# EAGLE design H3_MIDIController_Rev_2_MainBoard (EAGLE 7.6.0)
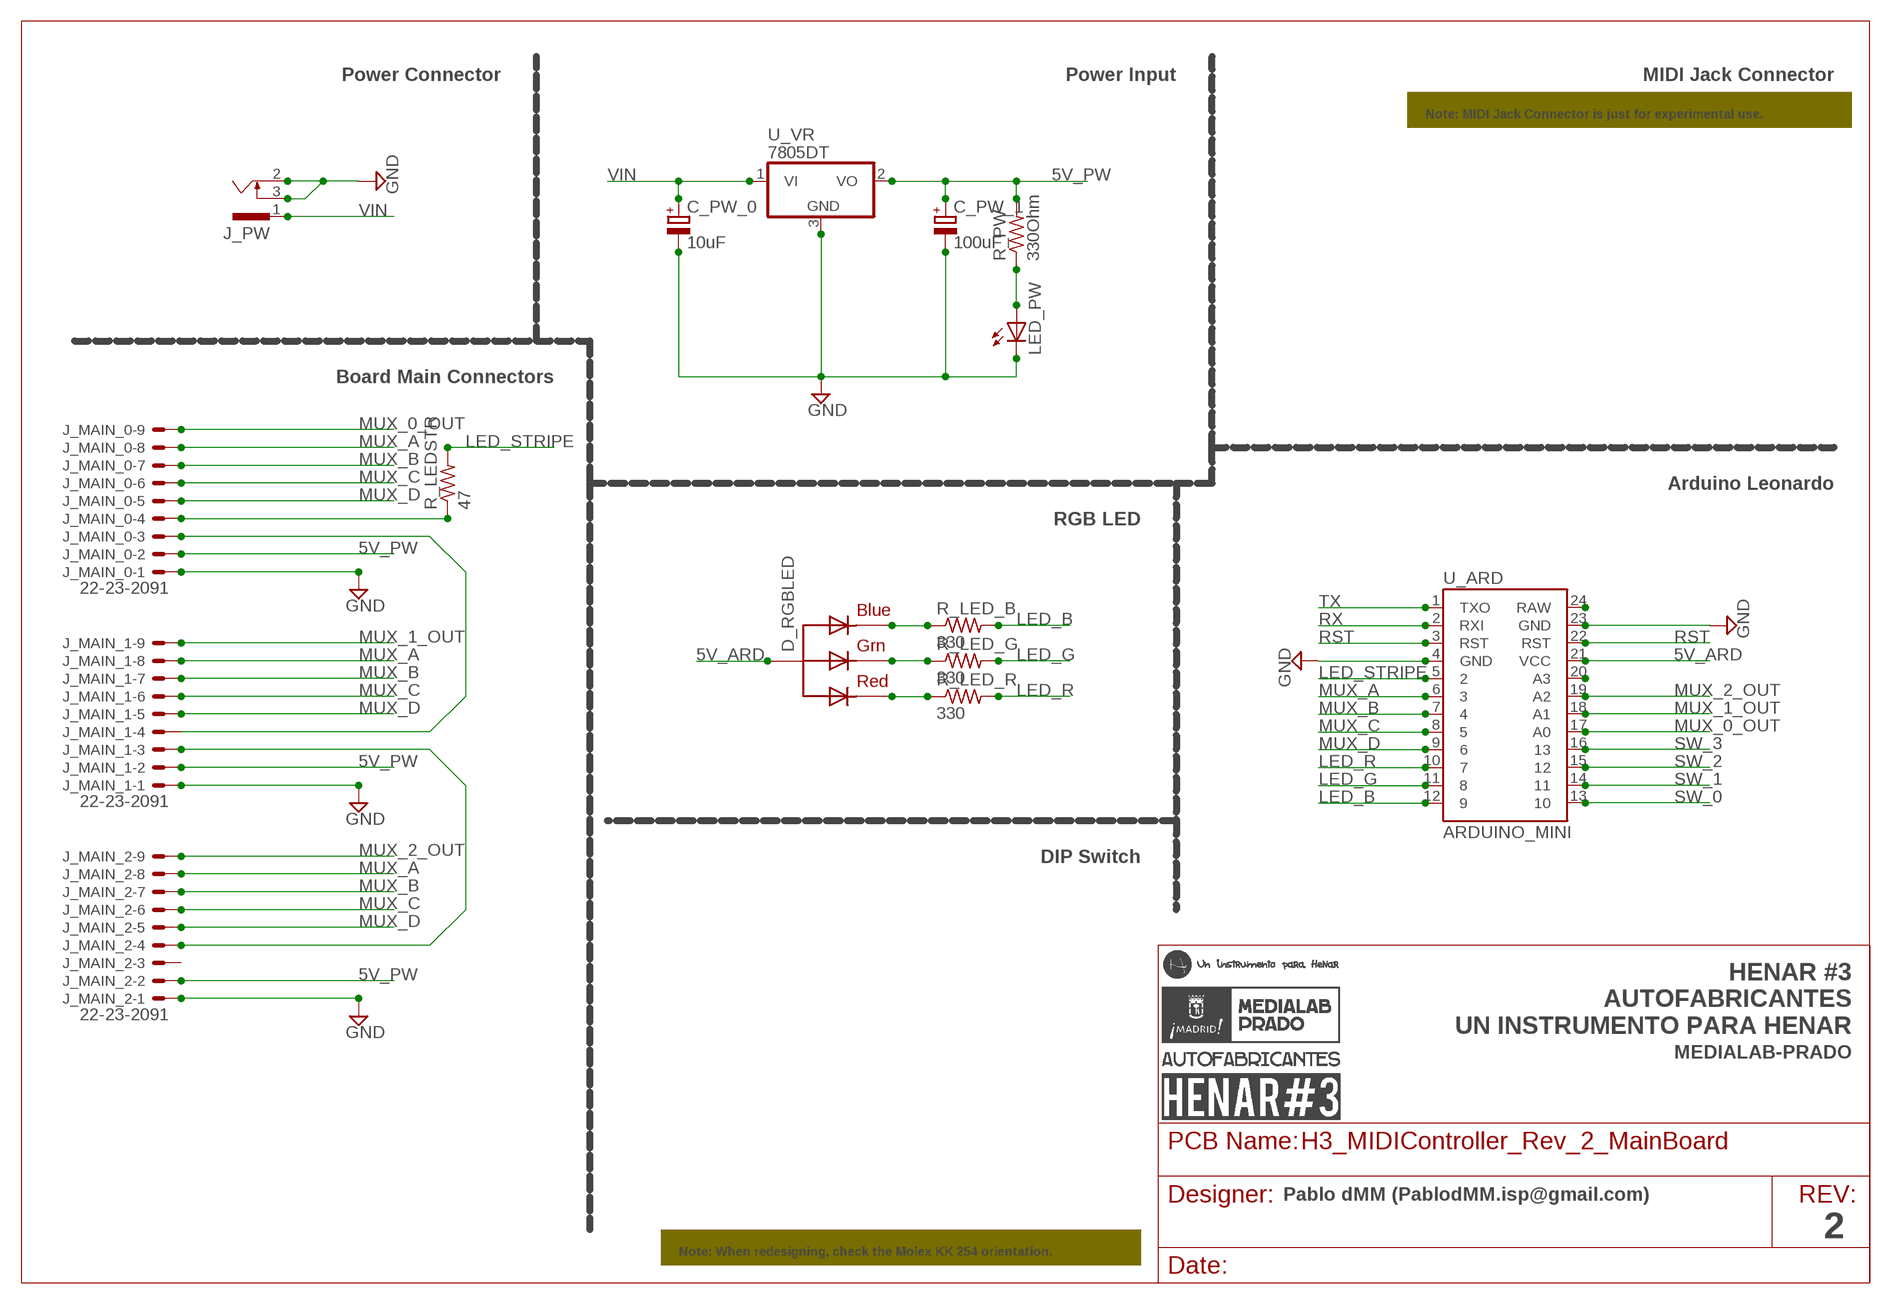
[diagram p0: schematic, sheet 1]

## Parts
C_PW_0  10uF  CPOL-EUTT2D6L  [TT2D6L]
C_PW_1  100uF  CPOL-EUTT2D6L  [TT2D6L]
D_RGBLED  RGBLED_CA-5MM  [LED5MMRGB]
J_MAIN_0  22-23-2091  [22-23-2091]
J_MAIN_1  22-23-2091  [22-23-2091]
J_MAIN_2  22-23-2091  [22-23-2091]
J_PW  SCD-014A  [SCD-014-A]
LED_PW  LEDSMT1206  [1206]
R_LED_B  330  R-US_M1206  [M1206]
R_LED_G  330  R-US_M1206  [M1206]
R_LED_R  330  R-US_M1206  [M1206]
R_LEDSTR  47  R-US_M1206  [M1206]
R_PW  330Ohm  R-US_M1206  [M1206]
U_ARD  ARDUINO_MINI  [ARDUINO_MINI]
U_VR  7805DT  [TO252]

## Nets
5V_ARD: D_RGBLED.2(VCC) U_ARD.21(VCC)
5V_PW [GND]: C_PW_1.+ J_MAIN_0.2 J_MAIN_1.2 J_MAIN_2.2 R_PW.2 U_VR.2(VO)
GND [GND]: C_PW_0.- C_PW_1.- J_MAIN_0.1 J_MAIN_1.1 J_MAIN_2.1 J_PW.2 J_PW.3 LED_PW.C U_ARD.4(GND) U_ARD.23(GND) U_VR.3(GND)
LED_B: R_LED_B.2 U_ARD.12
LED_G: R_LED_G.2 U_ARD.11
LED_OUT: J_MAIN_0.3 J_MAIN_1.4
LED_OUT1: J_MAIN_1.3 J_MAIN_2.4
LED_R: R_LED_R.2 U_ARD.10
LED_STRIPE: R_LEDSTR.2 U_ARD.5
MUX_0_OUT: J_MAIN_0.9 U_ARD.17(A0)
MUX_1_OUT: J_MAIN_1.9 U_ARD.18(A1)
MUX_2_OUT: J_MAIN_2.9 U_ARD.19(A2)
MUX_A: J_MAIN_0.8 J_MAIN_1.8 J_MAIN_2.8 U_ARD.6
MUX_B: J_MAIN_0.7 J_MAIN_1.7 J_MAIN_2.7 U_ARD.7
MUX_C: J_MAIN_0.6 J_MAIN_1.6 J_MAIN_2.6 U_ARD.8
MUX_D: J_MAIN_0.5 J_MAIN_1.5 J_MAIN_2.5 U_ARD.9
N$1: J_MAIN_0.4 R_LEDSTR.1
N$2: U_ARD.20(A3)
N$3: U_ARD.24(RAW)
N$5: LED_PW.A R_PW.1
N$8: D_RGBLED.4(BLUE) R_LED_B.1
N$9: D_RGBLED.3(GREEN) R_LED_G.1
N$10: D_RGBLED.1(RED) R_LED_R.1
RST: U_ARD.3(RST) U_ARD.22(RST)
RX: U_ARD.2(RXI)
SW_0: U_ARD.13
SW_1: U_ARD.14
SW_2: U_ARD.15
SW_3: U_ARD.16
TX: U_ARD.1(TXO)
VIN: C_PW_0.+ J_PW.1 U_VR.1(VI)
Unconnected: J_MAIN_2.3

## Notes on the sheet
- Power Connector | Power Input | MIDI Jack Connector
- Note: MIDI Jack Connector is just for experimental use.
- Board Main Connectors
- Arduino Leonardo
- RGB LED
- DIP Switch
- HENAR #3
  AUTOFABRICANTES
  UN INSTRUMENTO PARA HENAR
- MEDIALAB-PRADO
- Pablo dMM (PablodMM.isp@gmail.com)
- 2
- Note: When redesigning, check the Molex KK 254 orientation.

## Library data of the parts
C_PW_0 C_PW_1 = rcl:CPOL-EU: POLARIZED CAPACITOR, European symbol
D_RGBLED = adafruit:RGBLED_CA: RGB LED, common-anode 5MM Staggered pins 5mm Piranha package http://www.ladyada.net/library/pcb/eaglelibrary.html
J_MAIN_0 J_MAIN_1 J_MAIN_2 = con-molex:22-23-2091: .100" (2.54mm) Center Header - 9 Pin; MF: MOLEX; MPN: 22-23-2091; OC_FARNELL: 1756827; OC_NEWARK: 56H0450
J_PW = con-shiua-chyuan:SCD-014A: Power Jack 2.5mm; OC_FARNELL: unknown; OC_NEWARK: unknown
LED_PW = adafruit:LED: LED OSRAM: - CHIPLED LG R971, LG N971, LY N971, LG Q971, LY Q971, LO R971, LY R971 LH N974, LH R974 LS Q976, LO Q976, LY Q976 LO Q996 - Hyper CHIPLED LW Q18S LB Q993, LB Q99A, LB R99A - SideLED LS A670, LO A670, LY A670, LG A670, LP A670 LB A673, LV A673, LT A673, LW A673 LH A674 LY A675 LS A676, LA A676, LO A676, LY A676, LW A676 LS A679, LY A679, LG A679 - Hyper Micro SIDELED® LS Y876, LA Y876, LO Y876, LY Y876 LT Y87S - SmartLED LW L88C, LW L88S LB L89C, LB L89S, LG L890 LS L89K, LO L89K, LY L89K LS L896, LA L896, LO L896, LY L896 - TOPLED LS T670, LO T670, LY T670, LG T670, LP T670 LSG T670, LSP T670, LSY T670, LOP T670, LYG T670 LG T671, LOG T671, LSG T671 LB T673, LV T673, LT T673, LW T673 LH T674 LS T676, LA T676, LO T676, LY T676, LB T676, LH T676, LSB T676, LW T676 LB T67C, LV T67C, LT T67C, LS T67K, LO T67K, LY T67K, LW E67C LS E67B, LA E67B, LO E67B, LY E67B, LB E67C, LV E67C, LT E67C LW T67C LS T679, LY T679, LG T679 LS T770, LO T770, LY T770, LG T770, LP T770 LB T773, LV T773, LT T773, LW T773 LH T774 LS E675, LA E675, LY E675, LS T675 LS T776, LA T776, LO T776, LY T776, LB T776 LHGB T686 LT T68C, LB T68C - Hyper Mini TOPLED® LB M676 - Mini TOPLED Santana® LG M470 LS M47K, LO M47K, LY M47K Source: http://www.osram.convergy.de/
R_LED_B R_LED_G R_LED_R R_LEDSTR R_PW = adafruit:R-US_: RESISTOR, American symbol
U_ARD = SparkFun-Boards:ARDUINO_MINI: Arduino Pro Mini footprint
U_VR = adafruit:78*: Positive VOLTAGE REGULATOR Added bigger pads to the TO-92 package

## Net classes
1 GND: width 0.635 mm

## Board
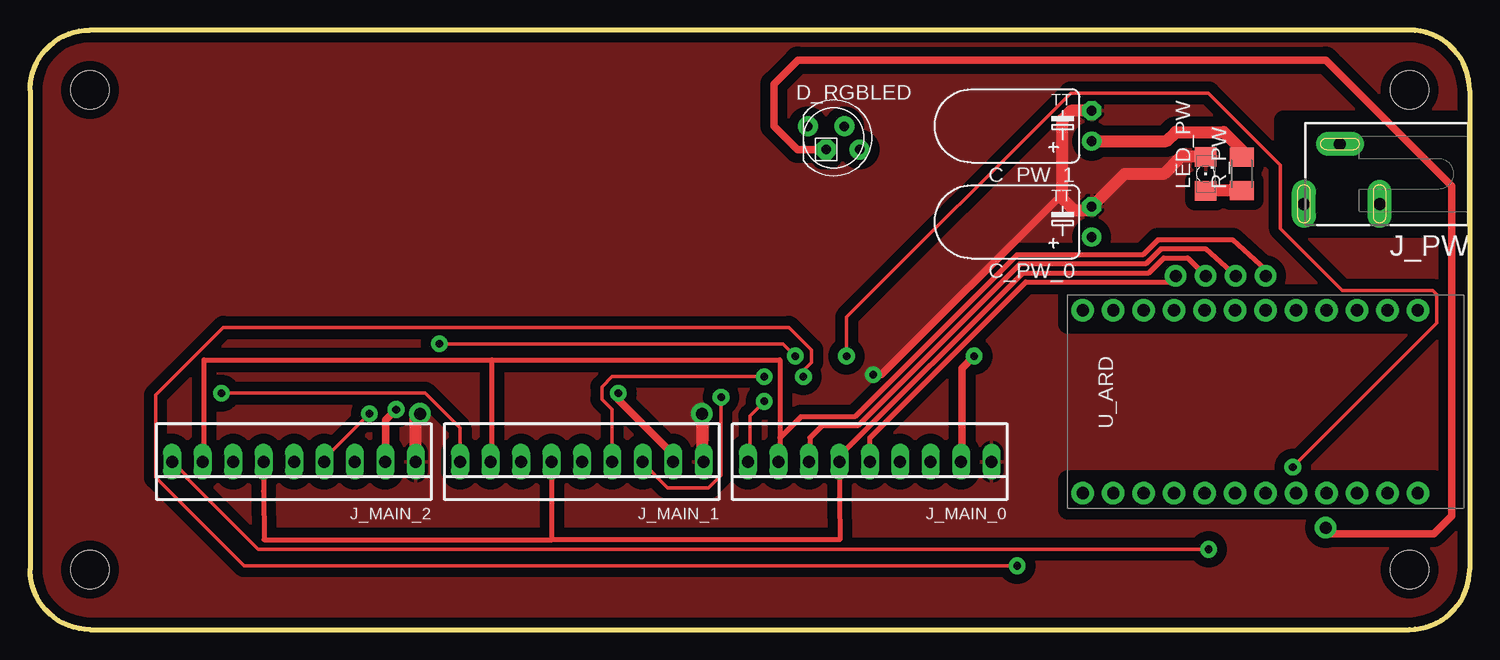
[diagram p1: board, top side]
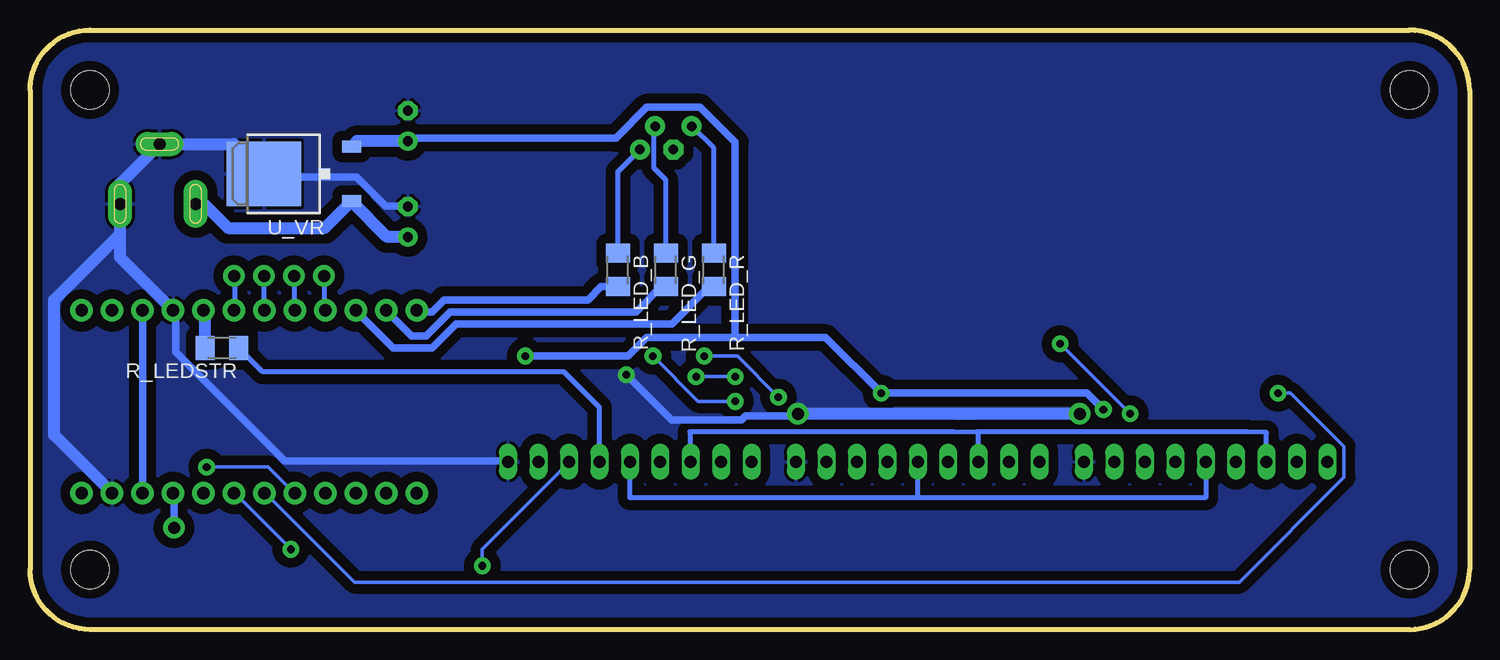
[diagram p2: board, bottom side, seen from below]

Size 120 x 50 mm. Coordinates in mm from the lower left corner, seen from the top.
Outline: 5,0 115,0 arc90 120,5 120,45 arc90 115,50 5,50 arc90 0,45 0,5 arc90 5,0
Copper layers (1*16): Top 0.035mm / dielectric 1.5mm / Bottom 0.035mm
Design rules "default *": minimum track width 12mil, minimum drill 25mil, track to track 15mil, track to pad 15mil, pad to pad 15mil, via to via 15mil, smd to smd 8mil, copper to edge 20mil, drill to drill 8mil, minimum pad ring 10mil, minimum via ring 15mil, stop-mask expansion 4mil, vias tented up to drill 0mil, thermal gap 10mil
Holes 3.2 mm at 115,45 115,5 5,5 5,45
tRestrict: area 86.5,25.5 to 117,28; area 86.5,10 to 117,12.5; area 104.5,33.5 to 120.5,42.5
vRestrict: area 106,34 to 120,42; area 11,0 to 81.5,16

### Footprints (pad centres in the part's own frame; a part is rotated, then mirrored left to right if it is on the bottom)
TT2D6L = drill 0.813 pad 1.6: + -1.27,0 | drill 0.813 pad 1.6 octagon: - 1.27,0
LED5MMRGB = drill 0.8 pad 1.676: 1 -2.159,0.968; 3 0.889,0.968; 4 2.159,-0.968 | drill 0.8 pad 1.676 octagon: 2 -0.635,-0.968
22-23-2091 = drill 1 long: 1 -10.16,0; 2 -7.62,0; 3 -5.08,0; 4 -2.54,0; 5 0,0; 6 2.54,0; 7 5.08,0; 8 7.62,0; 9 10.16,0
SCD-014-A = drill 1 pad 2 long: 1 -2.5,13.8; 2 -2.5,7.5; 3 2.5,10.8
1206 = smd 1.6 x 1.803: A -1.422,0; C 1.422,0
M1206 = smd 1.6 x 2: 1 -1.4,0; 2 1.4,0
ARDUINO_MINI = drill 1.016 pad 1.88: 1 -7.62,12.7; 2 -7.62,10.16; 3 -7.62,7.62; 4 -7.62,5.08; 5 -7.62,2.54; 6 -7.62,0; 7 -7.62,-2.54; 8 -7.62,-5.08; 9 -7.62,-7.62; 10 -7.62,-10.16; 11 -7.62,-12.7; 12 -7.62,-15.24; 13 7.62,-15.24; 14 7.62,-12.7; 15 7.62,-10.16; 16 7.62,-7.62; 17 7.62,-5.08; 18 7.62,-2.54; 19 7.62,0; 20 7.62,2.54; 21 7.62,5.08; 22 7.62,7.62; 23 7.62,10.16; 24 7.62,12.7
TO252 = smd 1 x 1.6: 1 -2.28,-4.8; 2 2.28,-4.8 | smd 5.4 x 6.2: 3 0,2.5

### Placement (x,y rotation side)
C_PW_0  88.5,34 90 top
C_PW_1  88.5,42 90 top
D_RGBLED  67,41 0 top
J_MAIN_0  70,14 180 top
J_MAIN_1  46,14 180 top
J_MAIN_2  22,14 180 top
J_PW  120,38 90 top
LED_PW  98,38 90 top
R_LED_B  71,30 270 bottom
R_LED_G  67,30 270 bottom
R_LED_R  63,30 270 bottom
R_LEDSTR  104,23.5 180 bottom
R_PW  101,38 90 top
U_ARD  103,19 270 top
U_VR  98,38 90 bottom

### Tracks (layer width: path | path; a pad name or v marks a point on that pad's centre or on a via)
5V_ARD  (via drill 1)
  Top 0.61: D_RGBLED.2 63.97,40.03 62,42 62,45.5 64,47.5 108,47.5 118.5,37 118.5,9.5 117,8 108.5,8 v108,8.5
  Bottom 0.61: v108,8.5 108,11.3 U_ARD.21
5V_PW  (via drill 0.64)
  Top 0.635: v30.52,18.34 29.66,17.49 29.66,14.06 J_MAIN_2.2 | v49.04,19.72 49.04,19.2 53.5,14.74 53.5,14.06 J_MAIN_1.2 | v78.7,22.8 77.67,21.77 77.67,14.06 J_MAIN_0.2
  Top 1.016: C_PW_1.+ 94.73,40.73 95.5,41.5 99.5,41.5 101,40 R_PW.2
  Bottom 0.635: v30.52,18.34 31.89,19.72 v49.04,19.72 53.67,24.35 61.21,24.35 | v78.7,22.8 70.13,22.8 68.58,24.35 61.21,24.35 | 61.21,24.35 61.21,40.63 64.13,43.55 68.58,43.55 71.16,40.98 88.13,40.98 C_PW_1.+
  Bottom 1.016: C_PW_1.+ 92.75,40.73 U_VR.2
GND  (via drill 0.64, 1)
  Top 0.635: v70.3,21.26 70.98,21.26 85.56,35.83 86,36
  Top 1.016: LED_PW.C 95.92,39.42 94.5,38 91.23,38 C_PW_0.- 88.23,35 87,35 86,36 86,42.5 86.77,43.27 C_PW_1.- | J_MAIN_2.1 32.16,17.66 v32.5,18 | v56,18 56,14.16 J_MAIN_1.1
  Bottom 0.635: J_MAIN_0.1 80.24,14.06 98.76,14.06 107.85,23.15 107.85,26.23 U_ARD.4 | C_PW_0.- 88.64,35.32 90.36,35.32 92.76,37.72 100.13,37.72 U_VR.3 | v70.3,21.26 66.53,17.49 60.7,17.49 60.35,17.83 56.41,17.83 v56,18
  Bottom 1.016: U_VR.3 103,40.5 J_PW.3 112.5,37.2 J_PW.2 112.5,33 | U_ARD.23 118,16.22 118,27.5 112.5,33 | U_ARD.4 112.5,31.04 112.5,33 | v32.5,18 v56,18
  pour Top (isolate 0.813): 0,5 0,45 arc-90 5,50 115,50 arc-90 120,45 120,5 arc-90 115,0 5,0 arc-90
  pour Bottom (isolate 0.813): 0,5 0,45 arc-90 5,50 115,50 arc-90 120,45 120,5 arc-90 115,0 5,0 arc-90
LED_B
  Bottom 0.61: R_LED_B.2 72.4,28.6 73.5,27.5 85.5,27.5 86.5,26.5 87.64,26.5 U_ARD.12
LED_G
  Bottom 0.61: R_LED_G.2 67.4,28.6 69.5,26.5 85,26.5 87,24.5 88.18,24.5 U_ARD.11
LED_OUT  (via drill 0.64)
  Top 0.305: v61.21,21.09 48.52,21.09 47.67,20.23 47.67,19.2 48.52,18.34 48.52,14.06 J_MAIN_1.4 | v64.47,21.09 64.47,21.6 65.16,22.29 65.16,23.32 63.27,25.2 16.12,25.2 10.46,19.55 10.46,12.69 17.84,5.32 v82.3,5.32
  Bottom 0.305: v64.47,21.09 v61.21,21.09 | v82.3,5.32 82.3,6.69 75.1,13.89 J_MAIN_0.3
LED_OUT1  (via drill 0.64)
  Top 0.305: v28.29,18 24.69,14.4 24.69,14.06 J_MAIN_2.4 | v34.12,23.83 62.75,23.83 v63.78,22.8 | v57.61,19.37 57.61,12.86 56.58,11.83 53.15,11.83 51.1,13.89 J_MAIN_1.3
  Bottom 0.305: v34.12,23.83 v28.29,18 | v63.78,22.8 61.04,22.8 v57.61,19.37
LED_R
  Bottom 0.61: R_LED_R.2 63.4,28.6 66.5,25.5 84.5,25.5 86.5,23.5 89.72,23.5 U_ARD.10
LED_STRIPE
  Bottom 1.016: R_LEDSTR.2 105.4,26.48 U_ARD.5
MUX_0_OUT  (via drill 0.64)
  Top 0.305: v61.21,19.03 60.01,17.83 60.01,14.06 J_MAIN_0.9 | v68.07,22.8 68.07,26.06 86.76,44.75 98.25,44.75 104.25,38.75 104.25,33.43 109.39,28.29 116.93,28.29 117.28,27.95 117.28,25.55 v105.27,13.54
  Bottom 0.305: v61.21,19.03 64.3,19.03 v68.07,22.8 | v105.27,13.54 100.13,13.54 98.07,11.49 U_ARD.17
MUX_1_OUT  (via drill 0.64)
  Top 0.305: v15.95,19.72 32.92,19.72 35.84,16.8 35.84,14.06 J_MAIN_1.9
  Bottom 0.305: v15.95,19.72 14.92,19.72 10.46,15.26 10.46,12.69 19.21,3.94 92.93,3.94 100.3,11.32 U_ARD.18
MUX_2_OUT  (via drill 0.64)
  Top 0.305: v98.25,6.69 19.03,6.69 13.03,12.69 13.03,12.86 12.01,13.89 J_MAIN_2.9
  Bottom 0.305: v98.25,6.69 102.87,11.32 U_ARD.19
MUX_A  (via drill 1)
  Top 0.305: J_MAIN_2.8 14.41,14.06 14.5,14.12
  Top 0.406: 14.5,14.12 14.5,22.5 38.5,22.5 | J_MAIN_1.8 38.5,14.12 38.5,22.5 | 38.5,22.5 62.5,22.5 62.5,16 | 62.5,16 62.5,14.12 J_MAIN_0.8 | v103,29.5 103,30 100.25,32.5 94,32.5 92.75,31.25 82.25,31.25 68.75,17.75 64.25,17.75 62.5,16
  Bottom 0.406: 102.88,26.62 102.88,29.38 v103,29.5
  Bottom 1.016: U_ARD.6 102.88,26.62
MUX_B  (via drill 1)
  Top 0.406: v100.5,29.5 98,31.75 94.25,31.75 93,30.5 82.5,30.5 69,17 66,17 65,16 65,14.08 J_MAIN_0.7
  Bottom 0.406: J_MAIN_2.7 16.92,16.42 18.5,16.5 41,16.5 41,14.08 J_MAIN_1.7 40.92,16.42 43,16.5 65,16.5 65,14.08 J_MAIN_0.7 | U_ARD.7 100.46,29.46 v100.5,29.5
MUX_C  (via drill 1)
  Top 0.406: J_MAIN_2.6 19.46,11.54 19.5,7.5 43.5,7.5 | 43.5,7.5 43.5,13.96 J_MAIN_1.6 | 43.5,7.5 67.5,7.5 67.46,10.96 J_MAIN_0.6 67.46,14.46 82.75,29.75 93.25,29.75 94.5,31 96.5,31 v98,29.5
  Bottom 0.406: v98,29.5 98,26.7 U_ARD.8
MUX_D  (via drill 1)
  Top 0.406: J_MAIN_0.5 70,16 83,29 95,29 v95.5,29.5
  Bottom 0.406: J_MAIN_2.5 22,11 46,11 | 46,11 J_MAIN_1.5 | 46,11 70,11 J_MAIN_0.5 | v95.5,29.5 95.5,26.74 U_ARD.9
N$1
  Bottom 0.406: J_MAIN_0.4 72.54,18.54 75.5,21.5 100.6,21.5 R_LEDSTR.1
N$4
  pour Top (isolate 0.813): 0,5 0,45 arc-90 5,50 115,50 arc-90 120,45 120,5 arc-90 115,0 5,0 arc-90
N$5
  Top 1.016: R_PW.1 98.02,36.6 LED_PW.A
N$6
  pour Bottom (isolate 0.813): 0,5 0,45 arc-90 5,50 115,50 arc-90 120,45 120,5 arc-90 115,0 5,0 arc-90
N$8
  Bottom 0.406: R_LED_B.1 71,38.19 D_RGBLED.4
N$9
  Bottom 0.406: R_LED_G.1 67,37.5 68,38.5 68,41.86 D_RGBLED.3
N$10
  Bottom 0.406: R_LED_R.1 63,40.13 D_RGBLED.1
RST
  Bottom 0.61: U_ARD.22 U_ARD.3
VIN
  Bottom 1.016: J_PW.1 105.5,35.5 103.5,33.5 95.42,33.5 U_VR.1 90.21,32.73 C_PW_0.+